# EAGLE design picotouch_grid (EAGLE 9.6.2)

## Sheet 1 of 3
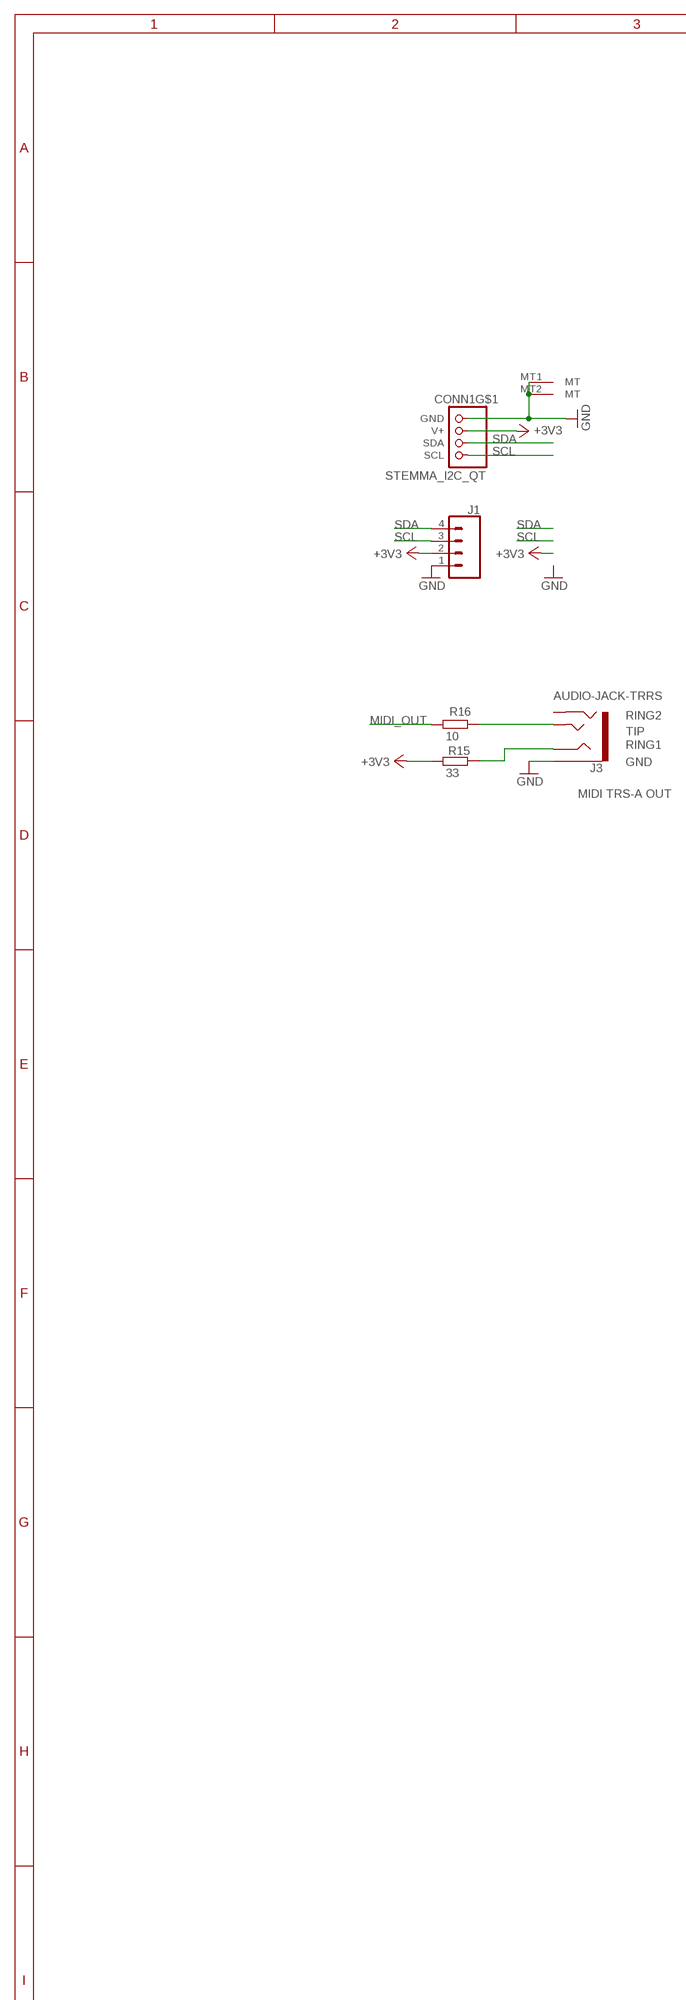
[diagram p0: schematic, sheet 1, part 1 of 2]
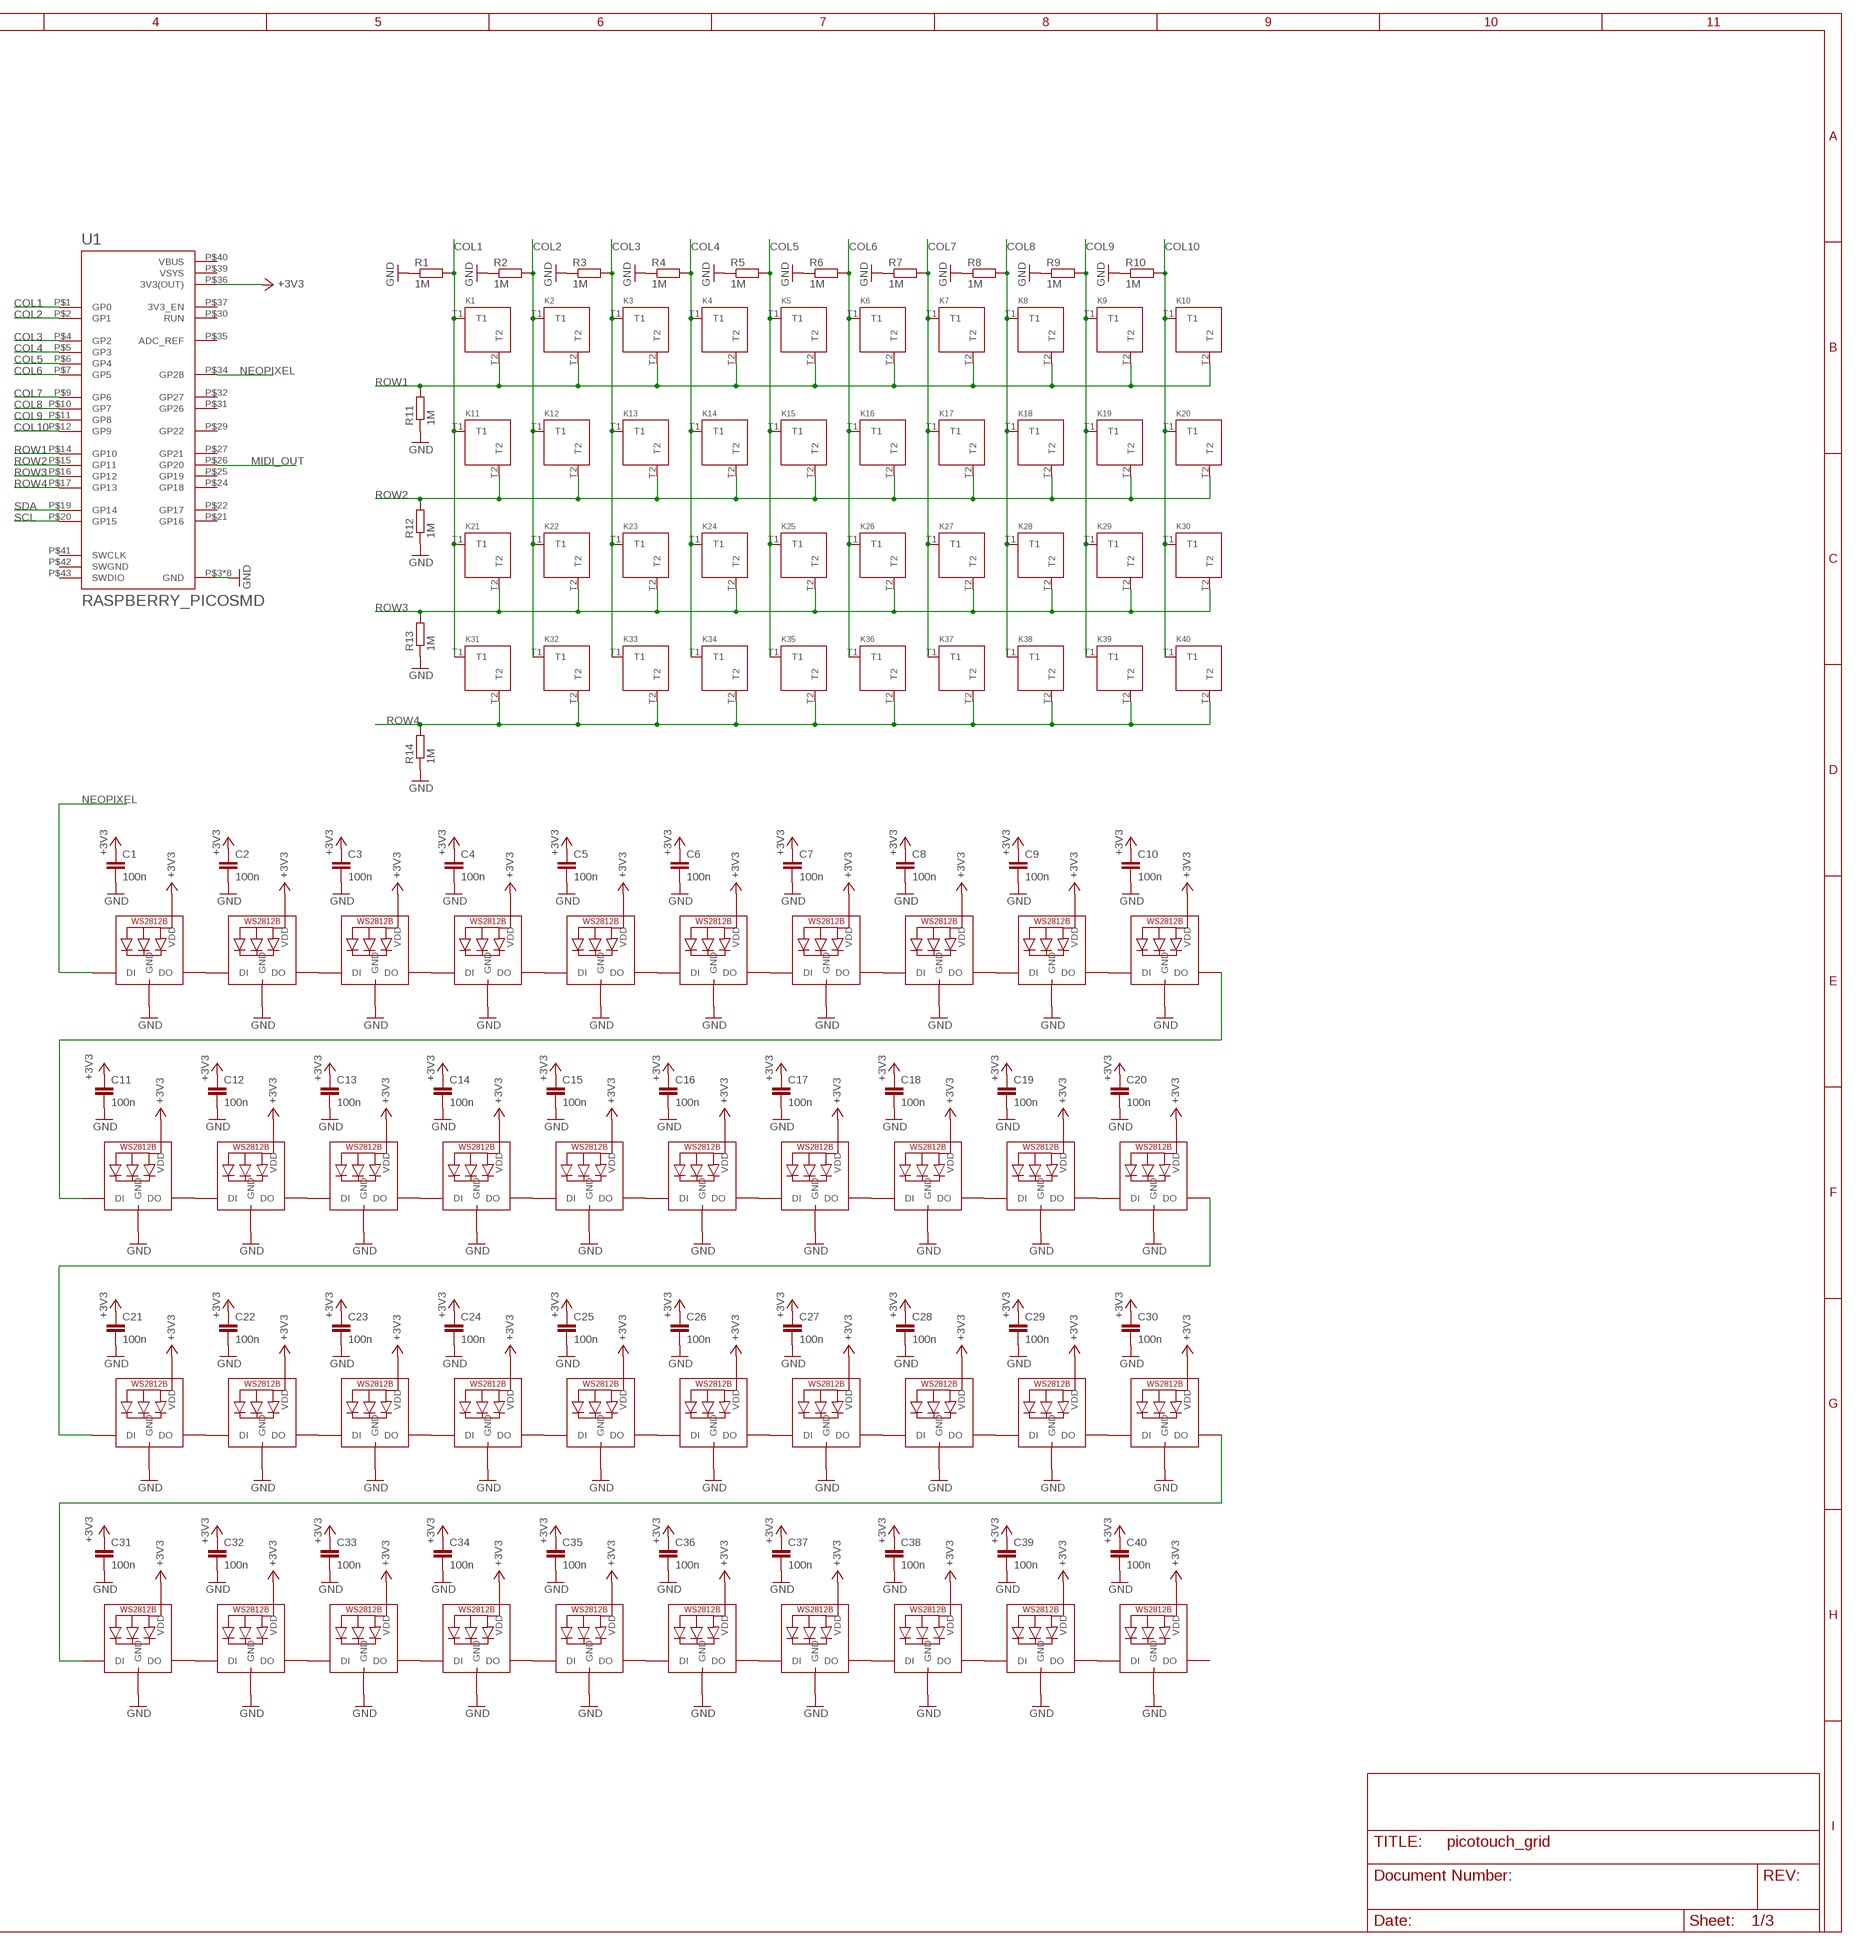
[diagram p1: schematic, sheet 1, part 2 of 2]

### Parts
C1  100n  C-EUC0805  [C0805]
C2  100n  C-EUC0805  [C0805]
C3  100n  C-EUC0805  [C0805]
C4  100n  C-EUC0805  [C0805]
C5  100n  C-EUC0805  [C0805]
C6  100n  C-EUC0805  [C0805]
C7  100n  C-EUC0805  [C0805]
C8  100n  C-EUC0805  [C0805]
C9  100n  C-EUC0805  [C0805]
C10  100n  C-EUC0805  [C0805]
C11  100n  C-EUC0805  [C0805]
C12  100n  C-EUC0805  [C0805]
C13  100n  C-EUC0805  [C0805]
C14  100n  C-EUC0805  [C0805]
C15  100n  C-EUC0805  [C0805]
C16  100n  C-EUC0805  [C0805]
C17  100n  C-EUC0805  [C0805]
C18  100n  C-EUC0805  [C0805]
C19  100n  C-EUC0805  [C0805]
C20  100n  C-EUC0805  [C0805]
C21  100n  C-EUC0805  [C0805]
C22  100n  C-EUC0805  [C0805]
C23  100n  C-EUC0805  [C0805]
C24  100n  C-EUC0805  [C0805]
C25  100n  C-EUC0805  [C0805]
C26  100n  C-EUC0805  [C0805]
C27  100n  C-EUC0805  [C0805]
C28  100n  C-EUC0805  [C0805]
C29  100n  C-EUC0805  [C0805]
C30  100n  C-EUC0805  [C0805]
C31  100n  C-EUC0805  [C0805]
C32  100n  C-EUC0805  [C0805]
C33  100n  C-EUC0805  [C0805]
C34  100n  C-EUC0805  [C0805]
C35  100n  C-EUC0805  [C0805]
C36  100n  C-EUC0805  [C0805]
C37  100n  C-EUC0805  [C0805]
C38  100n  C-EUC0805  [C0805]
C39  100n  C-EUC0805  [C0805]
C40  100n  C-EUC0805  [C0805]
CONN1  STEMMA_I2C_QT  [JST_SH4]
J1  CONN_04  [1X04]
J3  AUDIO-JACK-TRRS  [PJ-320D_SPARKFUN]
K1  TOUCHKEYH  [TOUCHPAD_KEY_0.5IN_LEDHOLE]
K2  TOUCHKEYH  [TOUCHPAD_KEY_0.5IN_LEDHOLE]
K3  TOUCHKEYH  [TOUCHPAD_KEY_0.5IN_LEDHOLE]
K4  TOUCHKEYH  [TOUCHPAD_KEY_0.5IN_LEDHOLE]
K5  TOUCHKEYH  [TOUCHPAD_KEY_0.5IN_LEDHOLE]
K6  TOUCHKEYH  [TOUCHPAD_KEY_0.5IN_LEDHOLE]
K7  TOUCHKEYH  [TOUCHPAD_KEY_0.5IN_LEDHOLE]
K8  TOUCHKEYH  [TOUCHPAD_KEY_0.5IN_LEDHOLE]
K9  TOUCHKEYH  [TOUCHPAD_KEY_0.5IN_LEDHOLE]
K10  TOUCHKEYH  [TOUCHPAD_KEY_0.5IN_LEDHOLE]
K11  TOUCHKEYH  [TOUCHPAD_KEY_0.5IN_LEDHOLE]
K12  TOUCHKEYH  [TOUCHPAD_KEY_0.5IN_LEDHOLE]
K13  TOUCHKEYH  [TOUCHPAD_KEY_0.5IN_LEDHOLE]
K14  TOUCHKEYH  [TOUCHPAD_KEY_0.5IN_LEDHOLE]
K15  TOUCHKEYH  [TOUCHPAD_KEY_0.5IN_LEDHOLE]
K16  TOUCHKEYH  [TOUCHPAD_KEY_0.5IN_LEDHOLE]
K17  TOUCHKEYH  [TOUCHPAD_KEY_0.5IN_LEDHOLE]
K18  TOUCHKEYH  [TOUCHPAD_KEY_0.5IN_LEDHOLE]
K19  TOUCHKEYH  [TOUCHPAD_KEY_0.5IN_LEDHOLE]
K20  TOUCHKEYH  [TOUCHPAD_KEY_0.5IN_LEDHOLE]
K21  TOUCHKEYH  [TOUCHPAD_KEY_0.5IN_LEDHOLE]
K22  TOUCHKEYH  [TOUCHPAD_KEY_0.5IN_LEDHOLE]
K23  TOUCHKEYH  [TOUCHPAD_KEY_0.5IN_LEDHOLE]
K24  TOUCHKEYH  [TOUCHPAD_KEY_0.5IN_LEDHOLE]
K25  TOUCHKEYH  [TOUCHPAD_KEY_0.5IN_LEDHOLE]
K26  TOUCHKEYH  [TOUCHPAD_KEY_0.5IN_LEDHOLE]
K27  TOUCHKEYH  [TOUCHPAD_KEY_0.5IN_LEDHOLE]
K28  TOUCHKEYH  [TOUCHPAD_KEY_0.5IN_LEDHOLE]
K29  TOUCHKEYH  [TOUCHPAD_KEY_0.5IN_LEDHOLE]
K30  TOUCHKEYH  [TOUCHPAD_KEY_0.5IN_LEDHOLE]
K31  TOUCHKEYH  [TOUCHPAD_KEY_0.5IN_LEDHOLE]
K32  TOUCHKEYH  [TOUCHPAD_KEY_0.5IN_LEDHOLE]
K33  TOUCHKEYH  [TOUCHPAD_KEY_0.5IN_LEDHOLE]
K34  TOUCHKEYH  [TOUCHPAD_KEY_0.5IN_LEDHOLE]
K35  TOUCHKEYH  [TOUCHPAD_KEY_0.5IN_LEDHOLE]
K36  TOUCHKEYH  [TOUCHPAD_KEY_0.5IN_LEDHOLE]
K37  TOUCHKEYH  [TOUCHPAD_KEY_0.5IN_LEDHOLE]
K38  TOUCHKEYH  [TOUCHPAD_KEY_0.5IN_LEDHOLE]
K39  TOUCHKEYH  [TOUCHPAD_KEY_0.5IN_LEDHOLE]
K40  TOUCHKEYH  [TOUCHPAD_KEY_0.5IN_LEDHOLE]
LED1  MICROBUILDER_WS2812B_SK6812E  [MICROBUILDER_NEO3535_REVERSE]
LED2  MICROBUILDER_WS2812B_SK6812E  [MICROBUILDER_NEO3535_REVERSE]
LED3  MICROBUILDER_WS2812B_SK6812E  [MICROBUILDER_NEO3535_REVERSE]
LED4  MICROBUILDER_WS2812B_SK6812E  [MICROBUILDER_NEO3535_REVERSE]
LED5  MICROBUILDER_WS2812B_SK6812E  [MICROBUILDER_NEO3535_REVERSE]
LED6  MICROBUILDER_WS2812B_SK6812E  [MICROBUILDER_NEO3535_REVERSE]
LED7  MICROBUILDER_WS2812B_SK6812E  [MICROBUILDER_NEO3535_REVERSE]
LED8  MICROBUILDER_WS2812B_SK6812E  [MICROBUILDER_NEO3535_REVERSE]
LED9  MICROBUILDER_WS2812B_SK6812E  [MICROBUILDER_NEO3535_REVERSE]
LED10  MICROBUILDER_WS2812B_SK6812E  [MICROBUILDER_NEO3535_REVERSE]
LED11  MICROBUILDER_WS2812B_SK6812E  [MICROBUILDER_NEO3535_REVERSE]
LED12  MICROBUILDER_WS2812B_SK6812E  [MICROBUILDER_NEO3535_REVERSE]
LED13  MICROBUILDER_WS2812B_SK6812E  [MICROBUILDER_NEO3535_REVERSE]
LED14  MICROBUILDER_WS2812B_SK6812E  [MICROBUILDER_NEO3535_REVERSE]
LED15  MICROBUILDER_WS2812B_SK6812E  [MICROBUILDER_NEO3535_REVERSE]
LED16  MICROBUILDER_WS2812B_SK6812E  [MICROBUILDER_NEO3535_REVERSE]
LED17  MICROBUILDER_WS2812B_SK6812E  [MICROBUILDER_NEO3535_REVERSE]
LED18  MICROBUILDER_WS2812B_SK6812E  [MICROBUILDER_NEO3535_REVERSE]
LED19  MICROBUILDER_WS2812B_SK6812E  [MICROBUILDER_NEO3535_REVERSE]
LED20  MICROBUILDER_WS2812B_SK6812E  [MICROBUILDER_NEO3535_REVERSE]
LED21  MICROBUILDER_WS2812B_SK6812E  [MICROBUILDER_NEO3535_REVERSE]
LED22  MICROBUILDER_WS2812B_SK6812E  [MICROBUILDER_NEO3535_REVERSE]
LED23  MICROBUILDER_WS2812B_SK6812E  [MICROBUILDER_NEO3535_REVERSE]
LED24  MICROBUILDER_WS2812B_SK6812E  [MICROBUILDER_NEO3535_REVERSE]
LED25  MICROBUILDER_WS2812B_SK6812E  [MICROBUILDER_NEO3535_REVERSE]
LED26  MICROBUILDER_WS2812B_SK6812E  [MICROBUILDER_NEO3535_REVERSE]
LED27  MICROBUILDER_WS2812B_SK6812E  [MICROBUILDER_NEO3535_REVERSE]
LED28  MICROBUILDER_WS2812B_SK6812E  [MICROBUILDER_NEO3535_REVERSE]
LED29  MICROBUILDER_WS2812B_SK6812E  [MICROBUILDER_NEO3535_REVERSE]
LED30  MICROBUILDER_WS2812B_SK6812E  [MICROBUILDER_NEO3535_REVERSE]
LED31  MICROBUILDER_WS2812B_SK6812E  [MICROBUILDER_NEO3535_REVERSE]
LED32  MICROBUILDER_WS2812B_SK6812E  [MICROBUILDER_NEO3535_REVERSE]
LED33  MICROBUILDER_WS2812B_SK6812E  [MICROBUILDER_NEO3535_REVERSE]
LED34  MICROBUILDER_WS2812B_SK6812E  [MICROBUILDER_NEO3535_REVERSE]
LED35  MICROBUILDER_WS2812B_SK6812E  [MICROBUILDER_NEO3535_REVERSE]
LED36  MICROBUILDER_WS2812B_SK6812E  [MICROBUILDER_NEO3535_REVERSE]
LED37  MICROBUILDER_WS2812B_SK6812E  [MICROBUILDER_NEO3535_REVERSE]
LED38  MICROBUILDER_WS2812B_SK6812E  [MICROBUILDER_NEO3535_REVERSE]
LED39  MICROBUILDER_WS2812B_SK6812E  [MICROBUILDER_NEO3535_REVERSE]
LED40  MICROBUILDER_WS2812B_SK6812E  [MICROBUILDER_NEO3535_REVERSE]
R1  1M  R-EU_R0805  [R0805]
R2  1M  R-EU_R0805  [R0805]
R3  1M  R-EU_R0805  [R0805]
R4  1M  R-EU_R0805  [R0805]
R5  1M  R-EU_R0805  [R0805]
R6  1M  R-EU_R0805  [R0805]
R7  1M  R-EU_R0805  [R0805]
R8  1M  R-EU_R0805  [R0805]
R9  1M  R-EU_R0805  [R0805]
R10  1M  R-EU_R0805  [R0805]
R11  1M  R-EU_R0805  [R0805]
R12  1M  R-EU_R0805  [R0805]
R13  1M  R-EU_R0805  [R0805]
R14  1M  R-EU_R0805  [R0805]
R15  33  R-EU_R0805  [R0805]
R16  10  R-EU_R0805  [R0805]
U1  RASPBERRY_PICOSMD  [PICO-PKG-SMD]

### Nets
+3V3: C1.1 C2.1 C3.1 C4.1 C5.1 C6.1 C7.1 C8.1 C9.1 C10.1 C11.1 C12.1 C13.1 C14.1 C15.1 C16.1 C17.1 C18.1 C19.1 C20.1 C21.1 C22.1 C23.1 C24.1 C25.1 C26.1 C27.1 C28.1 C29.1 C30.1 C31.1 C32.1 C33.1 C34.1 C35.1 C36.1 C37.1 C38.1 C39.1 C40.1 CONN1.2(V+) J1.2 LED1.1-VDD(VDD) LED2.1-VDD(VDD) LED3.1-VDD(VDD) LED4.1-VDD(VDD) LED5.1-VDD(VDD) LED6.1-VDD(VDD) LED7.1-VDD(VDD) LED8.1-VDD(VDD) LED9.1-VDD(VDD) LED10.1-VDD(VDD) LED11.1-VDD(VDD) LED12.1-VDD(VDD) LED13.1-VDD(VDD) LED14.1-VDD(VDD) LED15.1-VDD(VDD) LED16.1-VDD(VDD) LED17.1-VDD(VDD) LED18.1-VDD(VDD) LED19.1-VDD(VDD) LED20.1-VDD(VDD) LED21.1-VDD(VDD) LED22.1-VDD(VDD) LED23.1-VDD(VDD) LED24.1-VDD(VDD) LED25.1-VDD(VDD) LED26.1-VDD(VDD) LED27.1-VDD(VDD) LED28.1-VDD(VDD) LED29.1-VDD(VDD) LED30.1-VDD(VDD) LED31.1-VDD(VDD) LED32.1-VDD(VDD) LED33.1-VDD(VDD) LED34.1-VDD(VDD) LED35.1-VDD(VDD) LED36.1-VDD(VDD) LED37.1-VDD(VDD) LED38.1-VDD(VDD) LED39.1-VDD(VDD) LED40.1-VDD(VDD) R15.2 U1.P$36(3V3(OUT))
COL1: K1.T1 K11.T1 K21.T1 K31.T1 R1.2 U1.P$1(GP0)
COL2: K2.T1 K12.T1 K22.T1 K32.T1 R2.2 U1.P$2(GP1)
COL3: K3.T1 K13.T1 K23.T1 K33.T1 R3.2 U1.P$4(GP2)
COL4: K4.T1 K14.T1 K24.T1 K34.T1 R4.2 U1.P$5(GP3)
COL5: K5.T1 K15.T1 K25.T1 K35.T1 R5.2 U1.P$6(GP4)
COL6: K6.T1 K16.T1 K26.T1 K36.T1 R6.2 U1.P$7(GP5)
COL7: K7.T1 K17.T1 K27.T1 K37.T1 R7.2 U1.P$9(GP6)
COL8: K8.T1 K18.T1 K28.T1 K38.T1 R8.2 U1.P$10(GP7)
COL9: K9.T1 K19.T1 K29.T1 K39.T1 R9.2 U1.P$11(GP8)
COL10: K10.T1 K20.T1 K30.T1 K40.T1 R10.2 U1.P$12(GP9)
GND: C1.2 C2.2 C3.2 C4.2 C5.2 C6.2 C7.2 C8.2 C9.2 C10.2 C11.2 C12.2 C13.2 C14.2 C15.2 C16.2 C17.2 C18.2 C19.2 C20.2 C21.2 C22.2 C23.2 C24.2 C25.2 C26.2 C27.2 C28.2 C29.2 C30.2 C31.2 C32.2 C33.2 C34.2 C35.2 C36.2 C37.2 C38.2 C39.2 C40.2 CONN1.1(GND) CONN1.MT1(MT) CONN1.MT2(MT) J1.1 J3.EARTH LED1.3-GND(GND) LED2.3-GND(GND) LED3.3-GND(GND) LED4.3-GND(GND) LED5.3-GND(GND) LED6.3-GND(GND) LED7.3-GND(GND) LED8.3-GND(GND) LED9.3-GND(GND) LED10.3-GND(GND) LED11.3-GND(GND) LED12.3-GND(GND) LED13.3-GND(GND) LED14.3-GND(GND) LED15.3-GND(GND) LED16.3-GND(GND) LED17.3-GND(GND) LED18.3-GND(GND) LED19.3-GND(GND) LED20.3-GND(GND) LED21.3-GND(GND) LED22.3-GND(GND) LED23.3-GND(GND) LED24.3-GND(GND) LED25.3-GND(GND) LED26.3-GND(GND) LED27.3-GND(GND) LED28.3-GND(GND) LED29.3-GND(GND) LED30.3-GND(GND) LED31.3-GND(GND) LED32.3-GND(GND) LED33.3-GND(GND) LED34.3-GND(GND) LED35.3-GND(GND) LED36.3-GND(GND) LED37.3-GND(GND) LED38.3-GND(GND) LED39.3-GND(GND) LED40.3-GND(GND) R1.1 R2.1 R3.1 R4.1 R5.1 R6.1 R7.1 R8.1 R9.1 R10.1 R11.1 R12.1 R13.1 R14.1 U1.P$3(GND) U1.P$8(GND) U1.P$13(GND) U1.P$18(GND) U1.P$23(GND) U1.P$28(GND) U1.P$33(GND) U1.P$38(GND)
MIDI_OUT: R16.2 U1.P$26(GP20)
N$1: LED1.2-DOUT(DO) LED2.4-DIN(DI)
N$2: LED2.2-DOUT(DO) LED3.4-DIN(DI)
N$3: LED4.2-DOUT(DO) LED5.4-DIN(DI)
N$4: LED5.2-DOUT(DO) LED6.4-DIN(DI)
N$5: LED3.2-DOUT(DO) LED4.4-DIN(DI)
N$6: LED7.2-DOUT(DO) LED8.4-DIN(DI)
N$7: LED8.2-DOUT(DO) LED9.4-DIN(DI)
N$8: J3.TIP R16.1
N$9: LED11.2-DOUT(DO) LED12.4-DIN(DI)
N$10: LED9.2-DOUT(DO) LED10.4-DIN(DI)
N$11: LED6.2-DOUT(DO) LED7.4-DIN(DI)
N$12: LED14.2-DOUT(DO) LED15.4-DIN(DI)
N$13: LED15.2-DOUT(DO) LED16.4-DIN(DI)
N$14: LED13.2-DOUT(DO) LED14.4-DIN(DI)
N$15: LED17.2-DOUT(DO) LED18.4-DIN(DI)
N$16: LED18.2-DOUT(DO) LED19.4-DIN(DI)
N$17: LED19.2-DOUT(DO) LED20.4-DIN(DI)
N$18: LED16.2-DOUT(DO) LED17.4-DIN(DI)
N$19: LED12.2-DOUT(DO) LED13.4-DIN(DI)
N$20: LED21.2-DOUT(DO) LED22.4-DIN(DI)
N$21: LED22.2-DOUT(DO) LED23.4-DIN(DI)
N$22: LED24.2-DOUT(DO) LED25.4-DIN(DI)
N$23: LED25.2-DOUT(DO) LED26.4-DIN(DI)
N$24: LED23.2-DOUT(DO) LED24.4-DIN(DI)
N$25: LED27.2-DOUT(DO) LED28.4-DIN(DI)
N$26: LED28.2-DOUT(DO) LED29.4-DIN(DI)
N$27: LED31.2-DOUT(DO) LED32.4-DIN(DI)
N$28: LED29.2-DOUT(DO) LED30.4-DIN(DI)
N$29: LED26.2-DOUT(DO) LED27.4-DIN(DI)
N$30: LED34.2-DOUT(DO) LED35.4-DIN(DI)
N$31: LED35.2-DOUT(DO) LED36.4-DIN(DI)
N$32: LED33.2-DOUT(DO) LED34.4-DIN(DI)
N$33: LED37.2-DOUT(DO) LED38.4-DIN(DI)
N$34: LED38.2-DOUT(DO) LED39.4-DIN(DI)
N$35: LED39.2-DOUT(DO) LED40.4-DIN(DI)
N$36: LED36.2-DOUT(DO) LED37.4-DIN(DI)
N$37: LED32.2-DOUT(DO) LED33.4-DIN(DI)
N$38: J3.RING1 R15.1
NEOPIXEL: LED1.4-DIN(DI) U1.P$34(GP28)
NEOPIXEL0: LED10.2-DOUT(DO) LED11.4-DIN(DI)
NEOPIXEL1: LED20.2-DOUT(DO) LED21.4-DIN(DI)
NEOPIXEL2: LED30.2-DOUT(DO) LED31.4-DIN(DI)
ROW1: K1.T2 K2.T2 K3.T2 K4.T2 K5.T2 K6.T2 K7.T2 K8.T2 K9.T2 K10.T2 R11.2 U1.P$14(GP10)
ROW2: K11.T2 K12.T2 K13.T2 K14.T2 K15.T2 K16.T2 K17.T2 K18.T2 K19.T2 K20.T2 R12.2 U1.P$15(GP11)
ROW3: K21.T2 K22.T2 K23.T2 K24.T2 K25.T2 K26.T2 K27.T2 K28.T2 K29.T2 K30.T2 R13.2 U1.P$16(GP12)
ROW4: K31.T2 K32.T2 K33.T2 K34.T2 K35.T2 K36.T2 K37.T2 K38.T2 K39.T2 K40.T2 R14.2 U1.P$17(GP13)
SCL: CONN1.4(SCL) J1.3 U1.P$20(GP15)
SDA: CONN1.3(SDA) J1.4 U1.P$19(GP14)
Unconnected: J3.RING2 LED40.2-DOUT(DO) U1.P$21(GP16) U1.P$22(GP17) U1.P$24(GP18) U1.P$25(GP19) U1.P$27(GP21) U1.P$29(GP22) U1.P$30(RUN) U1.P$31(GP26) U1.P$32(GP27) U1.P$35(ADC_REF) U1.P$37(3V3_EN) U1.P$41(SWCLK) U1.P$43(SWDIO)

### Notes on the sheet
- RING2
- TIP
- RING1
- GND
- MIDI TRS-A OUT

## Sheet 2 of 3

## Sheet 3 of 3

## Power pins joined to a net without a drawn wire
SWGND: U1.P$42(SWGND)
VBUS: U1.P$40(VBUS)
VSYS: U1.P$39(VSYS)

## Library data of the parts
C1-C40 = rcl:C-EU: CAPACITOR, European symbol; SPICEPREFIX: C
CONN1 = adafruit_electromech:STEMMA_I2C; LCSC: C2845363; LCSC2: C160404; MPN: HC-1.0-4PWT; MPN2: SM04B-SRSS-TB
J1 = SparkFun-Connectors:CONN_04: Multi connection point. Often used as Generic Header-pin footprint for 0.1 inch spaced/style header connections On any of the 0.1 inch spaced packages, you can populate with these: Break Away Headers - Straight <https://www.sparkfun.com/products/116> (PRT-00116) Break Away Male Headers - Right Angle <https://www.sparkfun.com/products/553> (PRT-00553) Female Headers <https://www.sparkfun.com/products/115> (PRT-00115) Break Away Headers - Machine Pin <https://www.sparkfun.com/products/117> (PRT-00117) Break Away Female Headers - Swiss Machine Pin <https://www.sparkfun.com/products/743> (PRT-00743) For SCREWTERMINALS and SPRING TERMINALS visit here: Screw Terimnals on SparkFun.com <https://www.sparkfun.com/search/results?term=Screw+Terminals> (5mm/3.5mm/2.54mm spacing) This device is also useful as a general connection point to wire up your design to another part of your project. Our various solder wires solder well into these plated through hole pads. Hook-Up Wire - Assortment (Stranded, 22 AWG) <https://www.sparkfun.com/products/11375> (PRT-11375) Hook-Up Wire - Assortment (Solid Core, 22 AWG) <https://www.sparkfun.com/products/11367> (PRT-11367) View the entire wire category on our website here <https://www.sparkfun.com/categories/141> Special notes: Molex polarized connector foot print use with SKU : PRT-08231 with associated crimp pins and housings. 1MM SMD Version SKU: PRT-10208; PROD_ID: CONN-09696
J3 = audio_jacks_todbot:AUDIO-JACK-TRRS; LCSC: C431535; MPN: PJ-320D
K1-K40 = todstuff2023:TOUCHKEY
LED1-LED40 = Adafruit MacroPad 2040:MICROBUILDER_WS2812B
R1-R16 = rcl:R-EU_: RESISTOR, European symbol; SPICEPREFIX: R
U1 = RpiPico:RASPBERRY_PICO: Raspberry Pi Pico

## Board
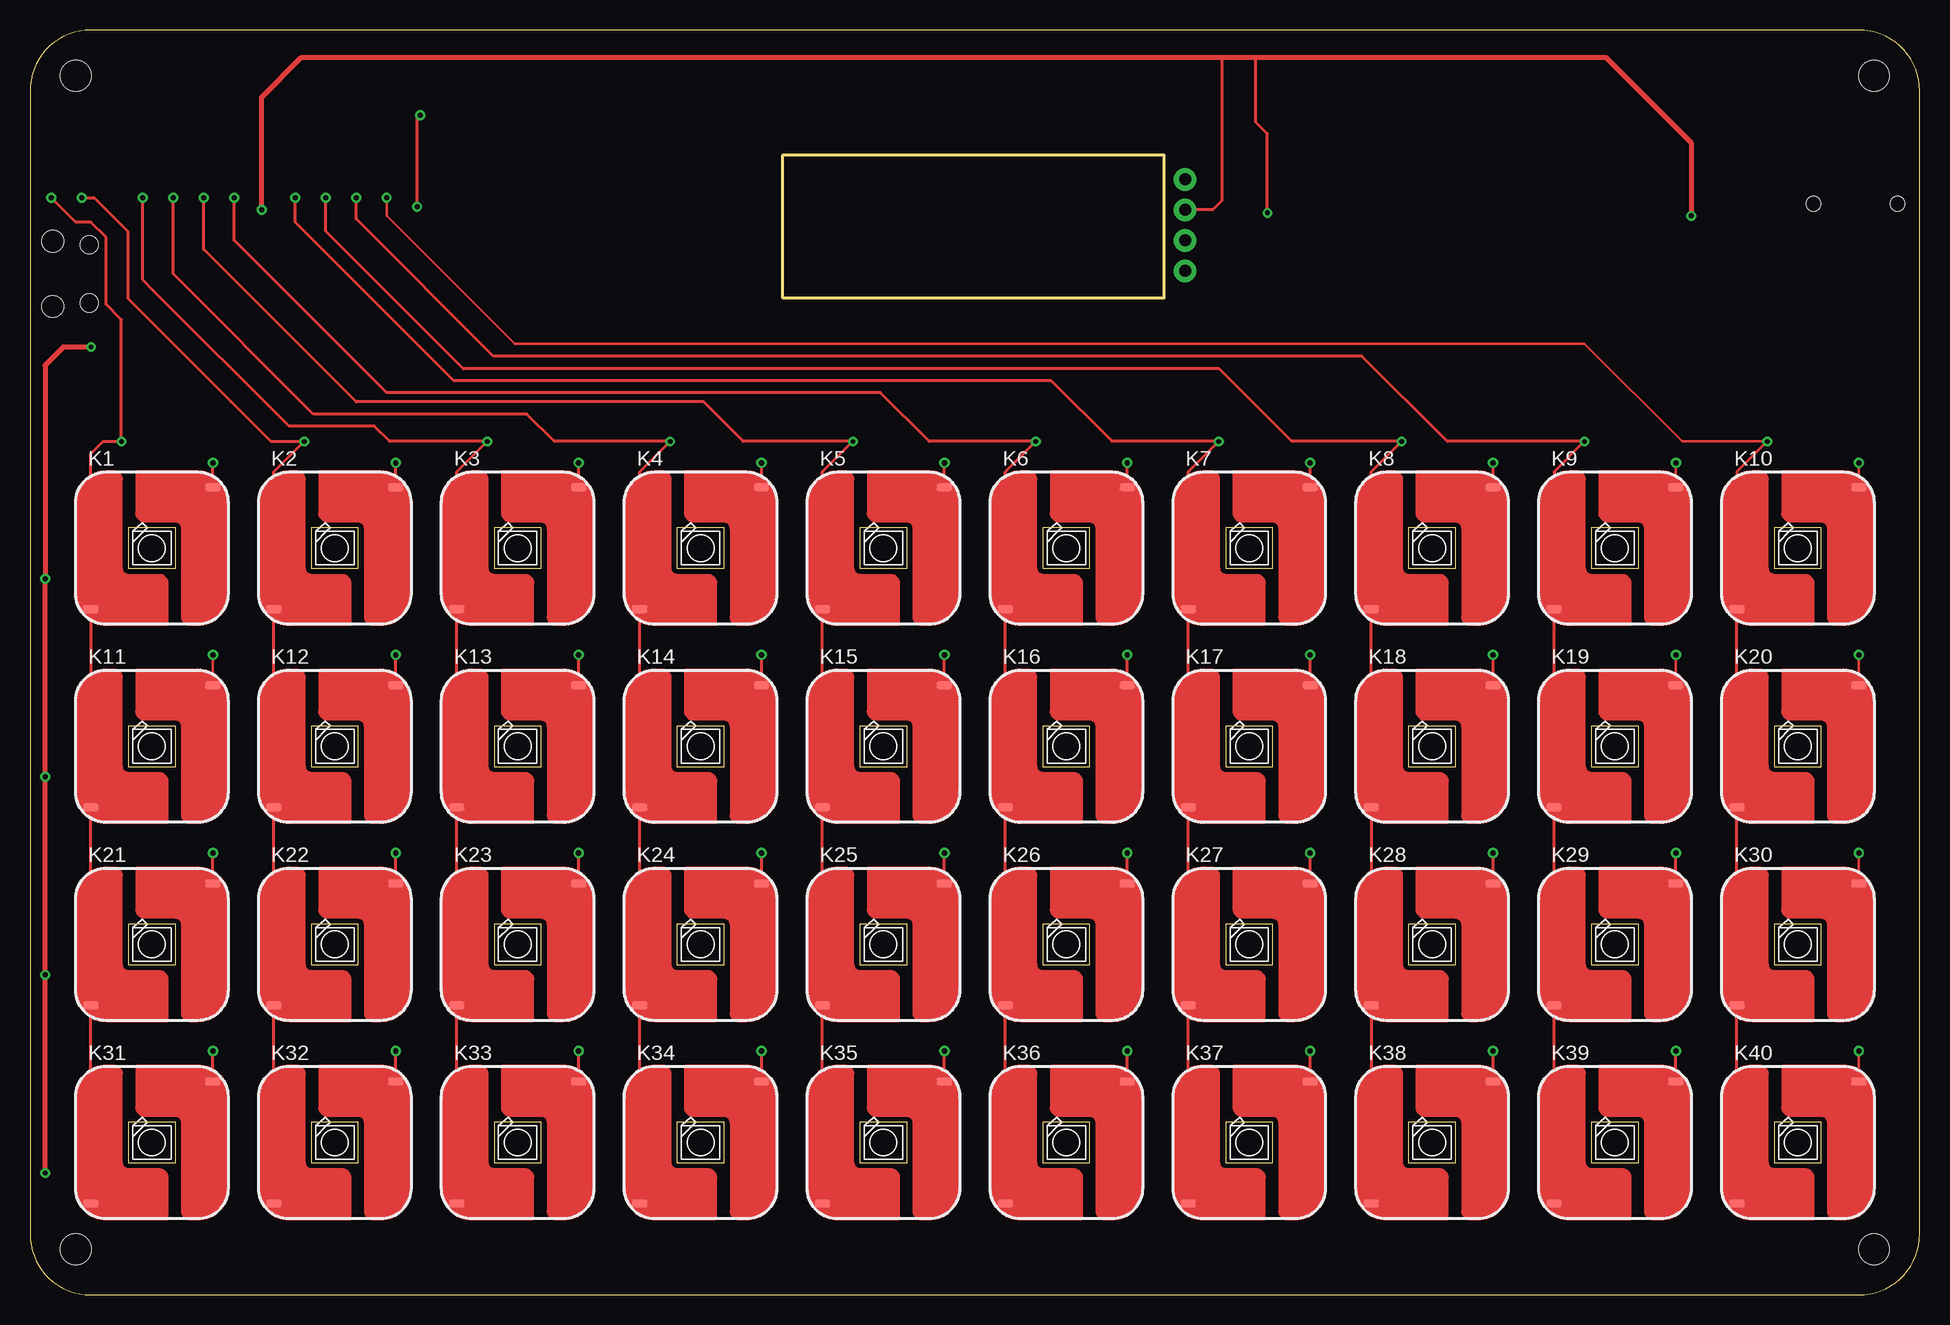
[diagram p2: board, top side]
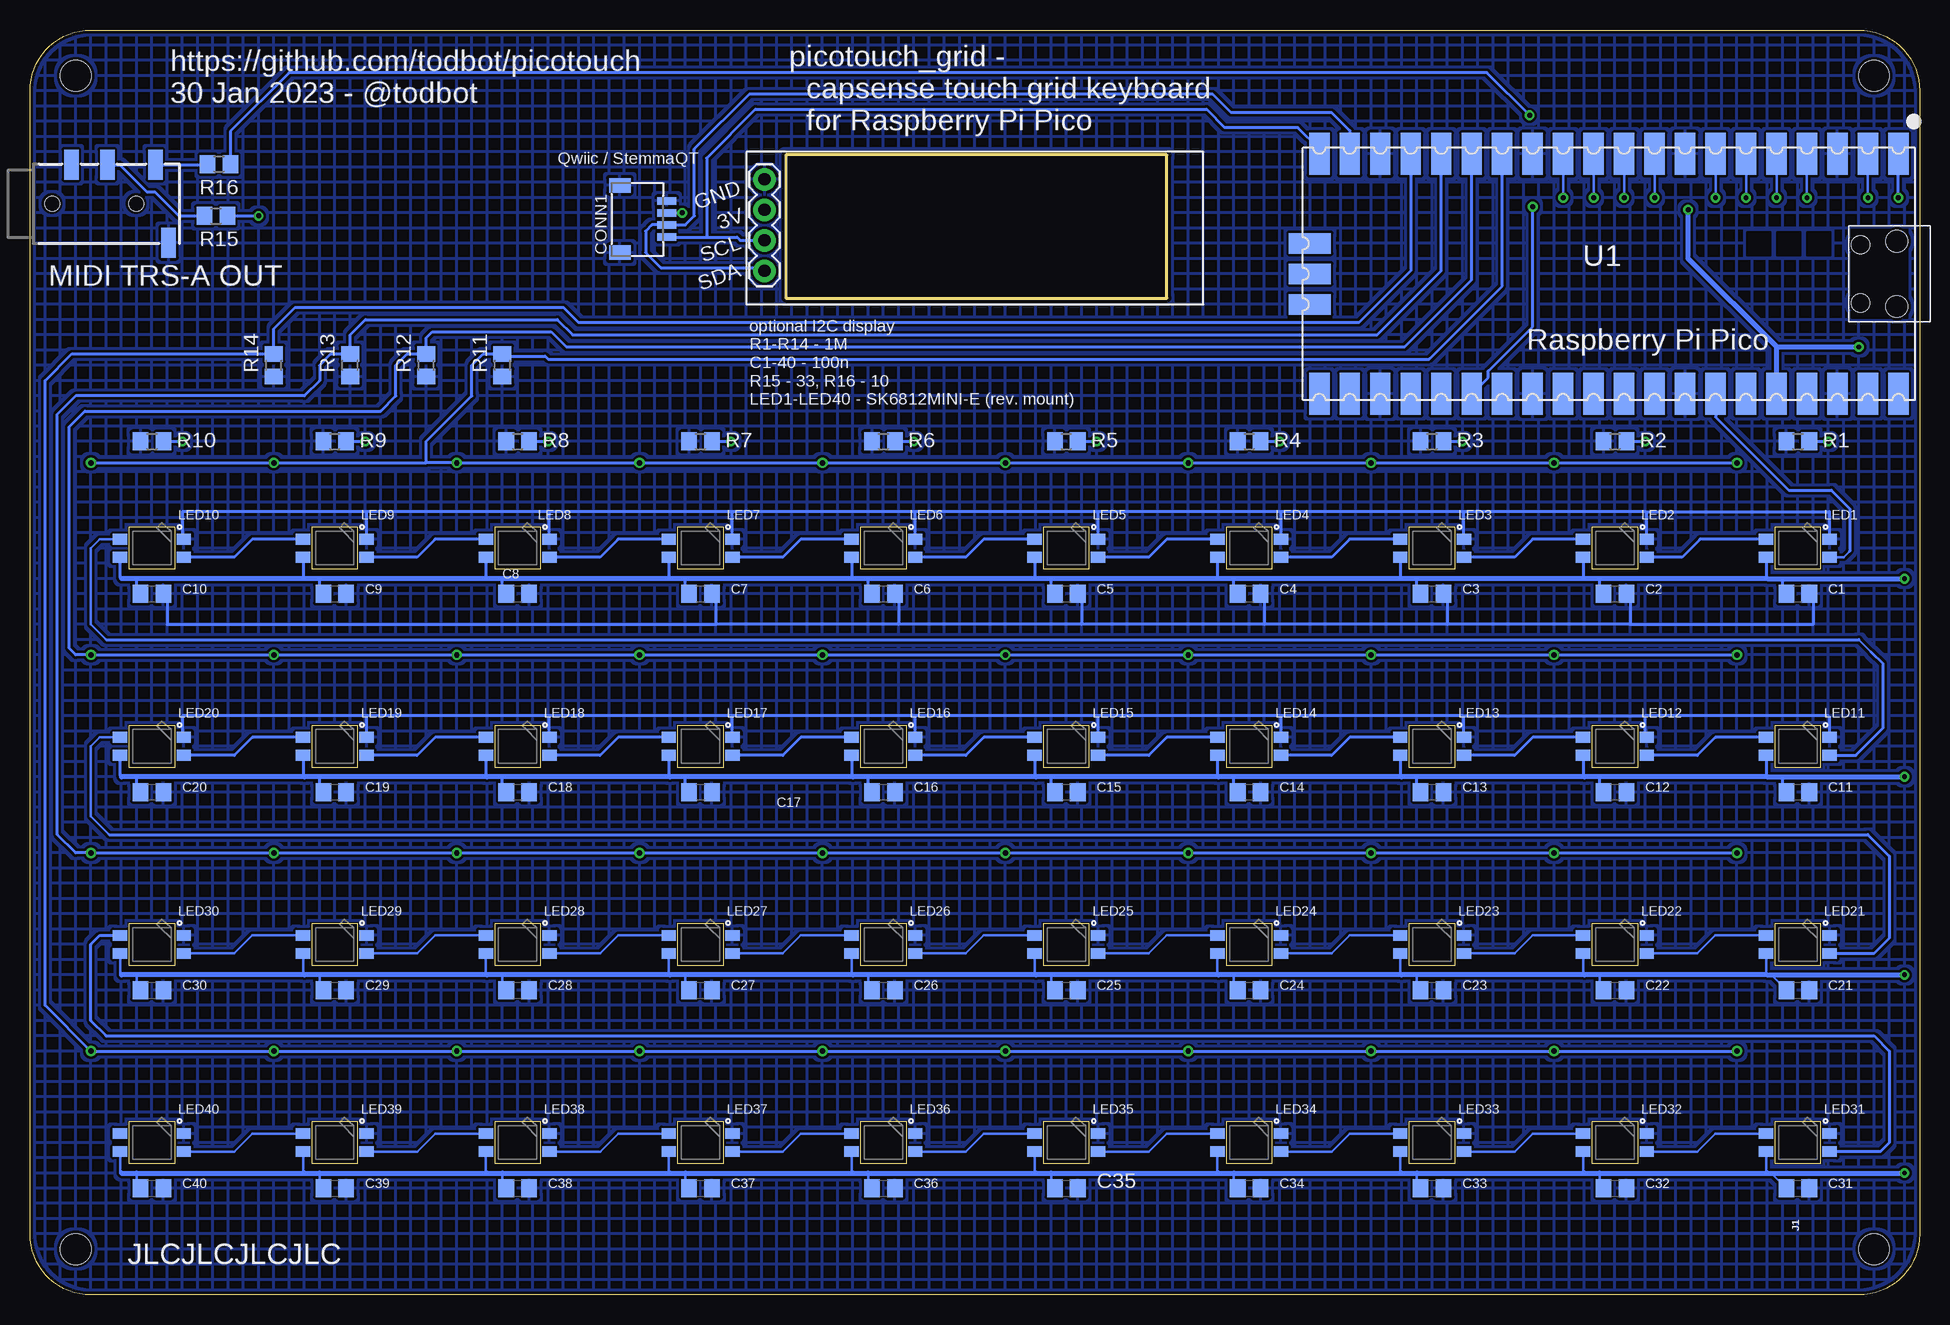
[diagram p3: board, bottom side, seen from below]

Size 157.48 x 105.41 mm. Coordinates in mm from the lower left corner, seen from the top.
Outline: 5.08,0 152.4,0 arc90 157.48,5.08 157.48,100.33 arc90 152.4,105.41 5.08,105.41 arc90 0,100.33 0,5.08 arc90 5.08,0
Outline: 62.74,95 94.49,95 94.49,83.06 62.74,83.06 62.74,95
Copper layers (1*16): Top 0.035mm / dielectric 1.5mm / Bottom 0.035mm
Design rules "adafruit-rules-20180530": minimum track width 8mil, minimum drill 16mil, track to track 8mil, track to pad 8mil, pad to pad 8mil, via to via 8mil, smd to smd 8mil, copper to edge 10mil, drill to drill 8mil, minimum pad ring 10mil, minimum via ring 8mil, stop-mask expansion 4mil, vias tented up to drill 20mil, thermal gap 10mil
Holes 2.54 mm at 3.81,101.6 153.67,101.6 153.67,3.81 3.81,3.81

### Footprints (pad centres in the part's own frame; a part is rotated, then mirrored left to right if it is on the bottom)
C0805 = smd 1.3 x 1.5: 1 -0.95,0; 2 0.95,0
JST_SH4 = smd 0.6 x 1.55: 1 -1.5,2.006; 2 -0.5,2.006; 3 0.5,2.006; 4 1.5,2.006 | smd 1.2 x 1.8: MT1 -2.8,-1.894; MT2 2.8,-1.894
1X04 = drill 1.016 pad 1.88: 1 0,0; 2 2.54,0; 3 5.08,0; 4 7.62,0
PJ-320D_SPARKFUN = smd 1.2 x 2.5: EARTH 11.3,-3.25; RING1 6.2,3.25; RING2 3.2,3.25; TIP 10.2,3.25 | hole 1.2: 1.6,0; 8.6,0
TOUCHPAD_KEY_0.5IN_LEDHOLE = smd 1.27 x 0.635: T1 -5.08,-5.08; T2 5.08,5.08
MICROBUILDER_NEO3535_REVERSE = smd 1.2 x 0.9 bottom: 1-VDD 2.65,-0.75; 2-DOUT 2.65,0.75; 3-GND -2.65,0.75; 4-DIN -2.65,-0.75
R0805 = smd 1.3 x 1.5: 1 -0.95,0; 2 0.95,0
PICO-PKG-SMD = smd 3.5 x 1.7: P$1 -10,24.13; P$2 -10,21.59; P$3 -10,19.05; P$4 -10,16.51; P$5 -10,13.97; P$6 -10,11.43; P$7 -10,8.89; P$8 -10,6.35; P$9 -10,3.81; P$10 -10,1.27; P$11 -10,-1.27; P$12 -10,-3.81; P$13 -10,-6.35; P$14 -10,-8.89; P$15 -10,-11.43; P$16 -10,-13.97; P$17 -10,-16.51; P$18 -10,-19.05; P$19 -10,-21.59; P$20 -10,-24.13; P$21 10,-24.13; P$22 10,-21.59; P$23 10,-19.05; P$24 10,-16.51; P$25 10,-13.97; P$26 10,-11.43; P$27 10,-8.89; P$28 10,-6.35; P$29 10,-3.81; P$30 10,-1.27; P$31 10,1.27; P$32 10,3.81; P$33 10,6.35; P$34 10,8.89; P$35 10,11.43; P$36 10,13.97; P$37 10,16.51; P$38 10,19.05; P$39 10,21.59; P$40 10,24.13 | smd 1.7 x 3.5: P$41 -2.54,-24.925; P$42 0,-24.925; P$43 2.54,-24.925 | hole 1.8: -2.725,24; 2.725,24 | hole 1.5: -2.425,20.97; 2.425,20.97

### Placement (x,y rotation side)
C1  10.16,58.42 0 bottom
C2  25.4,58.42 0 bottom
C3  40.64,58.42 0 bottom
C4  55.88,58.42 0 bottom
C5  71.12,58.42 0 bottom
C6  86.36,58.42 0 bottom
C7  101.6,58.42 0 bottom
C8  116.84,58.42 0 bottom
C9  132.08,58.42 0 bottom
C10  147.32,58.42 0 bottom
C11  10.16,41.91 0 bottom
C12  25.4,41.91 0 bottom
C13  40.64,41.91 0 bottom
C14  55.88,41.91 0 bottom
C15  71.12,41.91 0 bottom
C16  86.36,41.91 0 bottom
C17  101.6,41.91 0 bottom
C18  116.84,41.91 0 bottom
C19  132.08,41.91 0 bottom
C20  147.32,41.91 0 bottom
C21  10.16,25.4 0 bottom
C22  25.4,25.4 0 bottom
C23  40.64,25.4 0 bottom
C24  55.88,25.4 0 bottom
C25  71.12,25.4 0 bottom
C26  86.36,25.4 0 bottom
C27  101.6,25.4 0 bottom
C28  116.84,25.4 0 bottom
C29  132.08,25.4 0 bottom
C30  147.32,25.4 0 bottom
C31  10.16,8.89 0 bottom
C32  25.4,8.89 0 bottom
C33  40.64,8.89 0 bottom
C34  55.88,8.89 0 bottom
C35  71.12,8.89 0 bottom
C36  86.36,8.89 0 bottom
C37  101.6,8.89 0 bottom
C38  116.84,8.89 0 bottom
C39  132.08,8.89 0 bottom
C40  147.32,8.89 0 bottom
CONN1  106.43,89.66 270 bottom
J1  96.27,92.96 270 bottom
J3  157.23,90.93 0 bottom
K1  10.16,62.23 0 top
K2  25.4,62.23 0 top
K3  40.64,62.23 0 top
K4  55.88,62.23 0 top
K5  71.12,62.23 0 top
K6  86.36,62.23 0 top
K7  101.6,62.23 0 top
K8  116.84,62.23 0 top
K9  132.08,62.23 0 top
K10  147.32,62.23 0 top
K11  10.16,45.72 0 top
K12  25.4,45.72 0 top
K13  40.64,45.72 0 top
K14  55.88,45.72 0 top
K15  71.12,45.72 0 top
K16  86.36,45.72 0 top
K17  101.6,45.72 0 top
K18  116.84,45.72 0 top
K19  132.08,45.72 0 top
K20  147.32,45.72 0 top
K21  10.16,29.21 0 top
K22  25.4,29.21 0 top
K23  40.64,29.21 0 top
K24  55.88,29.21 0 top
K25  71.12,29.21 0 top
K26  86.36,29.21 0 top
K27  101.6,29.21 0 top
K28  116.84,29.21 0 top
K29  132.08,29.21 0 top
K30  147.32,29.21 0 top
K31  10.16,12.7 0 top
K32  25.4,12.7 0 top
K33  40.64,12.7 0 top
K34  55.88,12.7 0 top
K35  71.12,12.7 0 top
K36  86.36,12.7 0 top
K37  101.6,12.7 0 top
K38  116.84,12.7 0 top
K39  132.08,12.7 0 top
K40  147.32,12.7 0 top
LED1  10.16,62.23 0 top
LED2  25.4,62.23 0 top
LED3  40.64,62.23 0 top
LED4  55.88,62.23 0 top
LED5  71.12,62.23 0 top
LED6  86.36,62.23 0 top
LED7  101.6,62.23 0 top
LED8  116.84,62.23 0 top
LED9  132.08,62.23 0 top
LED10  147.32,62.23 0 top
LED11  10.16,45.72 0 top
LED12  25.4,45.72 0 top
LED13  40.64,45.72 0 top
LED14  55.88,45.72 0 top
LED15  71.12,45.72 0 top
LED16  86.36,45.72 0 top
LED17  101.6,45.72 0 top
LED18  116.84,45.72 0 top
LED19  132.08,45.72 0 top
LED20  147.32,45.72 0 top
LED21  10.16,29.21 0 top
LED22  25.4,29.21 0 top
LED23  40.64,29.21 0 top
LED24  55.88,29.21 0 top
LED25  71.12,29.21 0 top
LED26  86.36,29.21 0 top
LED27  101.6,29.21 0 top
LED28  116.84,29.21 0 top
LED29  132.08,29.21 0 top
LED30  147.32,29.21 0 top
LED31  10.16,12.7 0 top
LED32  25.4,12.7 0 top
LED33  40.64,12.7 0 top
LED34  55.88,12.7 0 top
LED35  71.12,12.7 0 top
LED36  86.36,12.7 0 top
LED37  101.6,12.7 0 top
LED38  116.84,12.7 0 top
LED39  132.08,12.7 0 top
LED40  147.32,12.7 0 top
R1  10.16,71.12 0 bottom
R2  25.4,71.12 0 bottom
R3  40.64,71.12 0 bottom
R4  55.88,71.12 0 bottom
R5  71.12,71.12 0 bottom
R6  86.36,71.12 0 bottom
R7  101.6,71.12 0 bottom
R8  116.84,71.12 0 bottom
R9  132.08,71.12 0 bottom
R10  147.32,71.12 0 bottom
R11  118.11,77.47 90 bottom
R12  124.46,77.47 90 bottom
R13  130.81,77.47 90 bottom
R14  137.16,77.47 90 bottom
R15  141.99,89.92 0 bottom
R16  141.73,94.23 0 bottom
U1  25.91,85.09 270 bottom

### Tracks (layer width: path | path; a pad name or v marks a point on that pad's centre or on a via)
+3V3  (via drill 0.41)
  Top 0.254: 102.12,103.12 102.12,97.78 103.12,96.77 v103.12,90.17 | 99.06,103.12 99.31,102.87 99.31,91.19 98.55,90.42 J1.2
  Top 0.406: v1.27,10.16 v1.27,26.67 v1.27,43.18 v1.27,59.69 1.27,77.47 2.79,78.99 v5.08,78.99 | v19.3,90.42 19.3,99.82 22.61,103.12 99.06,103.12 102.12,103.12 131.32,103.12 138.43,96.01 v138.43,89.92
  Bottom 0.203: C21.1 12.38,26.67 12.7,26.67 12.81,26.78 LED21.1-VDD | C30.1 148.59,25.72 148.59,26.67 | LED30.1-VDD 149.97,26.78 149.86,26.67 | LED29.1-VDD 134.73,26.78 134.62,26.67 | C29.1 133.35,25.72 133.35,26.67 | LED28.1-VDD 119.49,26.78 119.38,26.67 | C28.1 118.11,25.72 118.11,26.67 | C27.1 102.87,25.72 102.87,26.67 | LED27.1-VDD 104.25,26.78 104.14,26.67 | C26.1 87.63,25.72 87.63,26.67 | LED26.1-VDD 89.01,26.78 88.9,26.67 | C25.1 72.39,25.72 72.39,26.67 | LED25.1-VDD 73.77,26.78 73.66,26.67 | C24.1 57.15,25.72 57.15,26.67 | LED24.1-VDD 58.53,26.78 58.42,26.67 | C23.1 41.91,25.72 41.91,26.67 | LED23.1-VDD 43.29,26.78 43.18,26.67 | C22.1 26.67,25.72 26.67,26.67 | LED22.1-VDD 28.05,26.78 27.94,26.67 | C31.1 12.38,10.16 12.7,10.16 12.81,10.27 LED31.1-VDD | LED32.1-VDD 28.05,10.27 27.94,10.16 | LED33.1-VDD 43.29,10.27 43.18,10.16 | C33.1 41.91,9.21 41.91,10.16 | C32.1 26.67,9.21 26.67,10.16 | C34.1 57.15,9.21 57.15,10.16 | LED34.1-VDD 58.53,10.27 58.42,10.16 | C35.1 72.39,9.21 72.39,10.16 | LED35.1-VDD 73.77,10.27 73.66,10.16 | C36.1 87.63,9.21 87.63,10.16 | LED36.1-VDD 89.01,10.27 88.9,10.16 | C37.1 102.87,9.21 102.87,10.16 | LED37.1-VDD 104.25,10.27 104.14,10.16 | C38.1 118.11,9.21 118.11,10.16 | LED38.1-VDD 119.49,10.27 119.38,10.16 | C39.1 133.35,9.21 133.35,10.16 | LED39.1-VDD 134.73,10.27 134.62,10.16 | C40.1 148.59,9.21 148.59,10.16 | LED40.1-VDD 149.97,10.27 149.86,10.16
  Bottom 0.254: LED6.1-VDD 89.01,59.8 88.9,59.69 | C6.1 87.63,58.74 87.63,59.69 | C5.1 72.39,58.74 72.39,59.69 | LED5.1-VDD 73.77,59.8 73.66,59.69 | LED4.1-VDD 58.53,59.8 58.42,59.69 | C4.1 57.15,58.74 57.15,59.69 | C3.1 41.91,58.74 41.91,59.69 | LED3.1-VDD 43.29,59.8 43.18,59.69 | C2.1 26.67,58.74 26.67,59.69 | LED2.1-VDD 28.05,59.8 27.94,59.69 | C1.1 11.43,58.74 11.43,59.69 12.7,59.69 12.81,59.8 LED1.1-VDD | 149.86,43.18 149.97,43.29 LED20.1-VDD | C20.1 148.59,42.23 148.59,43.18 | 149.86,59.69 149.97,59.8 LED10.1-VDD | C10.1 148.59,58.74 148.59,59.69 | C9.1 133.35,58.74 133.35,59.69 | LED9.1-VDD 134.73,59.8 134.62,59.69 | LED8.1-VDD 119.49,59.8 119.38,59.69 | C8.1 118.11,58.74 118.11,59.69 | C7.1 102.87,58.74 102.87,59.69 | LED7.1-VDD 104.25,59.8 104.14,59.69 | LED11.1-VDD 12.81,43.29 12.7,43.18 | LED12.1-VDD 28.05,43.29 27.94,43.18 | LED19.1-VDD 134.73,43.29 134.62,43.18 | C19.1 133.35,42.23 133.35,43.18 | C18.1 118.11,42.23 118.11,43.18 | LED18.1-VDD 119.49,43.29 119.38,43.18 | LED17.1-VDD 104.25,43.29 104.14,43.18 | C17.1 102.87,42.23 102.87,43.18 | C16.1 87.63,42.23 87.63,43.18 | LED16.1-VDD 89.01,43.29 88.9,43.18 | LED15.1-VDD 73.77,43.29 73.66,43.18 | C15.1 72.39,42.23 72.39,43.18 | LED14.1-VDD 58.53,43.29 58.42,43.18 | C14.1 57.15,42.23 57.15,43.18 | LED13.1-VDD 43.29,43.29 43.18,43.18 | C13.1 41.91,42.23 41.91,43.18 | C12.1 26.67,42.23 26.67,43.18 | C11.1 11.43,42.23 11.43,43.18 | R15.2 v138.43,89.92 | CONN1.2 103.13,90.16 v103.12,90.17
  Bottom 0.406: 149.86,59.69 148.59,59.69 134.62,59.69 133.35,59.69 119.38,59.69 118.11,59.69 104.14,59.69 102.87,59.69 88.9,59.69 87.63,59.69 73.66,59.69 72.39,59.69 58.42,59.69 57.15,59.69 43.18,59.69 41.91,59.69 27.94,59.69 26.67,59.69 12.7,59.69 v1.27,59.69 | 149.86,43.18 148.59,43.18 134.62,43.18 133.35,43.18 119.38,43.18 118.11,43.18 104.14,43.18 102.87,43.18 88.9,43.18 87.63,43.18 73.66,43.18 72.39,43.18 58.42,43.18 57.15,43.18 43.18,43.18 41.91,43.18 27.94,43.18 26.67,43.18 12.7,43.18 11.43,43.18 v1.27,43.18 | 149.86,26.67 148.59,26.67 134.62,26.67 133.35,26.67 119.38,26.67 118.11,26.67 104.14,26.67 102.87,26.67 88.9,26.67 87.63,26.67 73.66,26.67 72.39,26.67 58.42,26.67 57.15,26.67 43.18,26.67 41.91,26.67 27.94,26.67 26.67,26.67 12.7,26.67 v1.27,26.67 | 149.86,10.16 148.59,10.16 134.62,10.16 133.35,10.16 119.38,10.16 118.11,10.16 104.14,10.16 102.87,10.16 88.9,10.16 87.63,10.16 73.66,10.16 72.39,10.16 58.42,10.16 57.15,10.16 43.18,10.16 41.91,10.16 27.94,10.16 26.67,10.16 12.7,10.16 v1.27,10.16 | U1.P$36 11.94,78.99 | 11.94,78.99 19.3,86.36 v19.3,90.42 | 11.94,78.99 v5.08,78.99
COL1  (via drill 0.41)
  Top 0.254: K31.T1 K21.T1 K11.T1 K1.T1 5.08,70.1 6.1,71.12 v7.62,71.12 7.62,81.28 6.35,82.55 6.35,88.14 5.08,89.41 3.81,89.41 v1.78,91.44
  Bottom 0.254: R1.2 v7.62,71.12 | v1.78,91.44 U1.P$1
COL2  (via drill 0.41)
  Top 0.254: K32.T1 K22.T1 K12.T1 K2.T1 20.32,68.58 v22.86,71.12 20.07,71.12 16.76,74.42 | v4.32,91.44 5.33,91.44 8.13,88.65 8.13,83.06 16.76,74.42 | 16.76,74.42
  Bottom 0.203: U1.P$2 v4.32,91.44
  Bottom 0.254: R2.2 v22.86,71.12
COL3  (via drill 0.41)
  Top 0.254: K33.T1 K23.T1 K13.T1 K3.T1 35.56,68.58 v38.1,71.12 29.97,71.12 28.7,72.39 21.59,72.39 10.29,83.69 9.4,84.58 v9.4,91.44
  Bottom 0.203: U1.P$4 v9.4,91.44
  Bottom 0.254: R3.2 v38.1,71.12
COL4  (via drill 0.41)
  Top 0.254: K34.T1 K24.T1 K14.T1 K4.T1 50.8,68.58 v53.34,71.12 43.69,71.12 41.4,73.41 23.62,73.41 11.94,85.09 v11.94,91.44
  Bottom 0.203: U1.P$5 v11.94,91.44
  Bottom 0.254: R4.2 v53.34,71.12
COL5  (via drill 0.41)
  Top 0.254: K35.T1 K25.T1 K15.T1 K5.T1 66.04,68.58 v68.58,71.12 59.44,71.12 56.13,74.42 27.18,74.42 14.48,87.12 v14.48,91.44
  Bottom 0.203: U1.P$6 v14.48,91.44
  Bottom 0.254: R5.2 v68.58,71.12
COL6  (via drill 0.41)
  Top 0.254: K36.T1 K26.T1 K16.T1 K6.T1 81.28,68.58 v83.82,71.12 74.93,71.12 70.87,75.18 29.72,75.18 17.02,87.88 v17.02,91.44
  Bottom 0.203: U1.P$7 v17.02,91.44
  Bottom 0.254: R6.2 v83.82,71.12
COL7  (via drill 0.41)
  Top 0.254: K37.T1 K27.T1 K17.T1 K7.T1 96.52,68.58 v99.06,71.12 90.17,71.12 85.09,76.2 35.31,76.2 22.1,89.41 v22.1,91.44
  Bottom 0.203: U1.P$9 v22.1,91.44
  Bottom 0.254: R7.2 v99.06,71.12
COL8  (via drill 0.41)
  Top 0.254: K38.T1 K28.T1 K18.T1 K8.T1 111.76,68.58 v114.3,71.12 105.16,71.12 99.11,77.17 36.12,77.17 24.64,88.65 v24.64,91.44
  Bottom 0.203: U1.P$10 v24.64,91.44
  Bottom 0.254: R8.2 v114.3,71.12
COL9  (via drill 0.41)
  Top 0.254: K39.T1 K29.T1 K19.T1 K9.T1 127,68.58 v129.54,71.12 118.11,71.12 111,78.23 38.61,78.23 27.18,89.66 v27.18,91.44
  Bottom 0.203: U1.P$11 v27.18,91.44
  Bottom 0.254: R9.2 v129.54,71.12
COL10  (via drill 0.41)
  Top 0.203: v144.78,71.12 137.67,71.12 129.54,79.25 40.39,79.25 29.72,89.92 v29.72,91.44
  Top 0.254: v144.78,71.12 142.24,68.58 K10.T1 K20.T1 K30.T1 K40.T1
  Bottom 0.203: U1.P$12 v29.72,91.44
  Bottom 0.254: R10.2 v144.78,71.12
GND
  Bottom 0.254: 24.13,55.88 39.37,55.88 | 39.37,55.88 54.61,55.88 | 54.61,55.88 69.85,55.88 | 69.85,55.88 85.09,55.88 | 85.09,55.88 100.33,55.88 | 100.33,55.88 146.05,55.88 146.05,58.1 C10.2 | C2.2 24.13,58.1 24.13,55.88 | C3.2 39.37,58.1 39.37,55.88 | C4.2 54.61,58.1 54.61,55.88 | C5.2 69.85,58.1 69.85,55.88 | 22.86,65.28 38.1,65.28 | 38.1,65.28 53.34,65.28 | 53.34,65.28 68.58,65.28 | 68.58,65.28 83.82,65.28 | 83.82,65.28 99.06,65.28 | 99.06,65.28 114.3,65.28 | 114.3,65.28 129.54,65.28 | 129.54,65.28 144.78,65.28 144.78,63.09 LED10.3-GND | LED6.3-GND 83.71,65.17 83.82,65.28 | LED5.3-GND 68.47,65.17 68.58,65.28 | LED4.3-GND 53.23,65.17 53.34,65.28 | LED3.3-GND 37.99,65.17 38.1,65.28 | LED2.3-GND 22.75,65.17 22.86,65.28 | LED1.3-GND 7.51,65.28 22.86,65.28 | LED9.3-GND 129.43,65.17 129.54,65.28 | LED8.3-GND 114.19,65.17 114.3,65.28 | LED7.3-GND 98.95,65.17 99.06,65.28 | C6.2 85.09,58.1 85.09,55.88 | C7.2 100.33,58.1 100.33,55.88 | 24.13,55.88 8.89,55.88 8.89,58.1 C1.2 | 38.1,48.26 22.86,48.26 | 38.1,48.26 53.34,48.26 | 53.34,48.26 68.58,48.26 | 68.58,48.26 83.82,48.26 | 83.82,48.26 99.06,48.26 | 99.06,48.26 114.3,48.26 | 114.3,48.26 129.54,48.26 | 129.54,48.26 144.78,48.26 144.78,46.58 LED20.3-GND | LED19.3-GND 129.43,48.15 129.54,48.26 | LED18.3-GND 114.19,48.15 114.3,48.26 | LED17.3-GND 98.95,48.15 99.06,48.26 | LED16.3-GND 83.71,48.15 83.82,48.26 | LED15.3-GND 68.47,48.15 68.58,48.26 | LED14.3-GND 53.23,48.15 53.34,48.26 | LED13.3-GND 37.99,48.15 38.1,48.26 | LED12.3-GND 22.86,46.58 22.86,48.26 | 22.86,48.26 7.62,48.26 7.51,48.15 LED11.3-GND
  pour Bottom (hatched): -1.01,-6.35 157.48,-6.35 157.48,106.57 -1.01,106.57
MIDI_OUT  (via drill 0.41)
  Top 0.254: v32.26,90.68 32.26,98.04 v32.51,98.3
  Bottom 0.254: U1.P$26 35.98,76.45 35.98,76.98 32.26,80.7 v32.26,90.68 | v32.51,98.3 36.07,101.85 135.89,101.85 140.78,96.96 R16.2
N$1
  Bottom 0.254: LED1.2-DOUT 18.3,62.98 19.8,61.48 LED2.4-DIN
N$2
  Bottom 0.254: LED2.2-DOUT 32.27,62.98 33.77,61.48 LED3.4-DIN
N$3
  Bottom 0.254: LED4.2-DOUT 62.75,62.98 64.25,61.48 LED5.4-DIN
N$4
  Bottom 0.254: LED5.2-DOUT 77.99,62.98 79.49,61.48 LED6.4-DIN
N$5
  Bottom 0.254: LED3.2-DOUT 47.51,62.98 49.01,61.48 LED4.4-DIN
N$6
  Bottom 0.254: LED7.2-DOUT 108.47,62.98 109.97,61.48 LED8.4-DIN
N$7
  Bottom 0.254: LED8.2-DOUT 123.71,62.98 125.21,61.48 LED9.4-DIN
N$8
  Bottom 0.254: J3.TIP 142.73,94.18 R16.1
N$9
  Bottom 0.254: LED11.2-DOUT 17.03,46.47 18.53,44.97 LED12.4-DIN
N$10
  Bottom 0.254: LED9.2-DOUT 138.95,62.98 140.45,61.48 LED10.4-DIN
N$11
  Bottom 0.254: LED6.2-DOUT 93.23,62.98 94.73,61.48 LED7.4-DIN
N$12
  Bottom 0.254: LED14.2-DOUT 62.75,46.47 64.25,44.97 LED15.4-DIN
N$13
  Bottom 0.254: LED15.2-DOUT 77.99,46.47 79.49,44.97 LED16.4-DIN
N$14
  Bottom 0.254: LED13.2-DOUT 47.51,46.47 49.01,44.97 LED14.4-DIN
N$15
  Bottom 0.254: LED17.2-DOUT 108.47,46.47 109.97,44.97 LED18.4-DIN
N$16
  Bottom 0.254: LED18.2-DOUT 123.71,46.47 125.21,44.97 LED19.4-DIN
N$17
  Bottom 0.254: LED19.2-DOUT 138.95,46.47 140.45,44.97 LED20.4-DIN
N$18
  Bottom 0.254: LED16.2-DOUT 93.23,46.47 94.73,44.97 LED17.4-DIN
N$19
  Bottom 0.254: LED12.2-DOUT 32.27,46.47 33.77,44.97 LED13.4-DIN
N$20
  Bottom 0.203: LED21.2-DOUT 17.03,29.96 18.53,28.46 LED22.4-DIN
N$21
  Bottom 0.203: LED22.2-DOUT 32.27,29.96 33.77,28.46 LED23.4-DIN
N$22
  Bottom 0.203: LED24.2-DOUT 62.75,29.96 64.25,28.46 LED25.4-DIN
N$23
  Bottom 0.203: LED25.2-DOUT 77.99,29.96 79.49,28.46 LED26.4-DIN
N$24
  Bottom 0.203: LED23.2-DOUT 47.51,29.96 49.01,28.46 LED24.4-DIN
N$25
  Bottom 0.203: LED27.2-DOUT 108.47,29.96 109.97,28.46 LED28.4-DIN
N$26
  Bottom 0.203: LED28.2-DOUT 123.71,29.96 125.21,28.46 LED29.4-DIN
N$27
  Bottom 0.203: LED31.2-DOUT 17.03,13.45 18.53,11.95 LED32.4-DIN
N$28
  Bottom 0.203: LED29.2-DOUT 138.95,29.96 140.45,28.46 LED30.4-DIN
N$29
  Bottom 0.203: LED26.2-DOUT 93.23,29.96 94.73,28.46 LED27.4-DIN
N$30
  Bottom 0.203: LED34.2-DOUT 62.75,13.45 64.25,11.95 LED35.4-DIN
N$31
  Bottom 0.203: LED35.2-DOUT 77.99,13.45 79.49,11.95 LED36.4-DIN
N$32
  Bottom 0.203: LED33.2-DOUT 47.51,13.45 49.01,11.95 LED34.4-DIN
N$33
  Bottom 0.203: LED37.2-DOUT 108.47,13.45 109.97,11.95 LED38.4-DIN
N$34
  Bottom 0.203: LED38.2-DOUT 123.71,13.45 125.21,11.95 LED39.4-DIN
N$35
  Bottom 0.203: LED39.2-DOUT 138.95,13.45 140.45,11.95 LED40.4-DIN
N$36
  Bottom 0.203: LED36.2-DOUT 93.23,13.45 94.73,11.95 LED37.4-DIN
N$37
  Bottom 0.203: LED32.2-DOUT 32.27,13.45 33.77,11.95 LED33.4-DIN
N$38
  Bottom 0.254: J3.RING1 150.01,94.18 147.74,91.91 147.08,91.91 145.08,89.92 R15.1
NEOPIXEL
  Bottom 0.203: LED1.4-DIN 6.34,61.48 5.84,61.98
  Bottom 0.254: U1.P$34 17.02,73.15 10.92,67.06 7.37,67.06 5.84,65.53 5.84,61.98
NEOPIXEL0
  Bottom 0.203: 151.13,54.61 152.4,55.88 152.4,62.23 151.65,62.98 LED10.2-DOUT | 5.08,54.61 4.06,53.59
  Bottom 0.254: LED11.4-DIN 5.32,44.97 3.05,47.24 3.05,52.58 4.06,53.59 | 151.13,54.61 5.08,54.61
NEOPIXEL1
  Bottom 0.203: 150.88,38.35 152.4,39.88 152.4,45.72 151.65,46.47 LED20.2-DOUT
  Bottom 0.254: 150.88,38.35 4.32,38.35 2.54,36.58 2.54,29.73 3.81,28.46 LED21.4-DIN
NEOPIXEL2
  Bottom 0.254: LED31.4-DIN 3.29,11.95 2.54,12.7 2.54,20.32 3.81,21.59 151.13,21.59 152.4,22.86 152.4,29.21 151.65,29.96 LED30.2-DOUT
ROW1  (via drill 0.45)
  Top 0.203: K10.T2 v152.4,69.34 | K9.T2 v137.16,69.34
  Top 0.254: K1.T2 v15.24,69.34 | K2.T2 v30.48,69.34 | K3.T2 v45.72,69.34 | K4.T2 v60.96,69.34 | K5.T2 v76.2,69.34 | K6.T2 v91.44,69.34 | K7.T2 v106.68,69.34 | K8.T2 v121.92,69.34
  Bottom 0.203: R11.2 117.92,78.23
  Bottom 0.254: v152.4,69.34 v137.16,69.34 124.46,69.34 | 124.46,69.34 v121.92,69.34 v106.68,69.34 v91.44,69.34 v76.2,69.34 v60.96,69.34 v45.72,69.34 v30.48,69.34 v15.24,69.34 | 124.46,69.34 124.46,71.12 120.65,74.93 120.65,77.47 119.7,78.42 R11.2 | 117.92,78.23 114.55,78.23 114.3,77.98 40.89,77.98 34.8,84.07 U1.P$14
ROW2  (via drill 0.45)
  Top 0.203: K20.T2 v152.4,53.34 | K19.T2 v137.16,53.34 | K11.T2 v15.24,53.34
  Top 0.254: K12.T2 v30.48,53.34 | K13.T2 v45.72,53.34 | K14.T2 v60.96,53.34 | K15.T2 v76.2,53.34 | K16.T2 v91.44,53.34 | K18.T2 v121.92,53.34 | K17.T2 v106.68,53.34
  Bottom 0.254: v15.24,53.34 v30.48,53.34 v45.72,53.34 v60.96,53.34 v76.2,53.34 v91.44,53.34 v106.68,53.34 v121.92,53.34 v137.16,53.34 v152.4,53.34 153.67,53.34 154.23,53.9 154.23,72.34 152.91,73.66 128.27,73.66 127,74.93 127,77.47 126.05,78.42 R12.2 124.46,79.76 123.95,80.26 114.05,80.26 112.78,78.99 42.93,78.99 37.34,84.58 U1.P$15
ROW3  (via drill 0.45)
  Top 0.203: K30.T2 v152.4,36.83
  Top 0.254: K21.T2 v15.24,36.83 | K22.T2 v30.48,36.83 | K29.T2 v137.16,36.83 | K28.T2 v121.92,36.83 | K27.T2 v106.68,36.83 | K26.T2 v91.44,36.83 | K25.T2 v76.2,36.83 | K24.T2 v60.96,36.83 | K23.T2 v45.72,36.83
  Bottom 0.254: v15.24,36.83 v30.48,36.83 v45.72,36.83 v60.96,36.83 v76.2,36.83 v91.44,36.83 v106.68,36.83 v121.92,36.83 v137.16,36.83 v152.4,36.83 153.67,36.83 155.19,38.35 155.19,73.41 153.67,74.93 134.62,74.93 133.35,76.2 133.35,77.47 132.4,78.42 R13.2 130.81,80.01 129.54,81.28 113.54,81.28 112.27,80.01 45.21,80.01 39.88,85.34 U1.P$16
ROW4  (via drill 0.45)
  Top 0.203: K40.T2 v152.4,20.32
  Top 0.254: K31.T2 v15.24,20.32 | K35.T2 v76.2,20.32 | K36.T2 v91.44,20.32 | K34.T2 v60.96,20.32 | K37.T2 v106.68,20.32 | K38.T2 v121.92,20.32 | K39.T2 v137.16,20.32 | K32.T2 v30.48,20.32 | K33.T2 v45.72,20.32
  Bottom 0.254: v15.24,20.32 v30.48,20.32 v45.72,20.32 v60.96,20.32 v76.2,20.32 v91.44,20.32 v106.68,20.32 v121.92,20.32 v137.16,20.32 v152.4,20.32 156.21,24.13 156.21,76.2 153.99,78.42 R14.2 137.16,80.52 135.38,82.3 113.03,82.3 111.76,81.03 46.74,81.03 42.42,85.34 U1.P$17
SCL
  Bottom 0.254: U1.P$20 50.04,95.5 51.82,97.28 57.91,97.28 59.44,98.81 97.03,98.81 101.09,94.74 101.09,88.14 | J1.3 98.3,87.88 98.58,88.16 98.6,88.14 101.09,88.14 | CONN1.4 104.4,88.14 101.09,88.14
SDA
  Bottom 0.254: 47.5,93.47 U1.P$19 47.5,97.03 49.02,98.55 57.4,98.55 58.93,100.08 97.54,100.08 102.11,95.5 102.11,89.92 102.86,89.16 CONN1.3 105.66,89.16 106.17,88.65 106.17,86.87 104.9,85.6 96.52,85.6 J1.4

### Text on the board
bPlace: https://github.com/todbot/picotouch / 30 Jan 2023 - @todbot | picotouch_grid - / capsense touch grid keyboard / for Raspberry Pi Pico | optional I2C display / R1-R14 - 1M / C1-40 - 100n / R15 - 33, R16 - 10 / LED1-LED40 - SK6812MINI-E (rev. mount)
bNames: Qwiic / StemmaQT | GND | 3V | SCL | SDA | MIDI TRS-A OUT | Raspberry Pi Pico | JLCJLCJLCJLC